# Altium schematic sheet DSO_RAM.SchDoc: Schematic_Name
size A4; CompanyName: University of Melbourne; Engineer: Your Name Here; DocumentNumber: 1; Revision: 0.1; SheetNumber: 1; SheetTotal: 1; Title_Project: Project_Title; StudentNo: Student No.
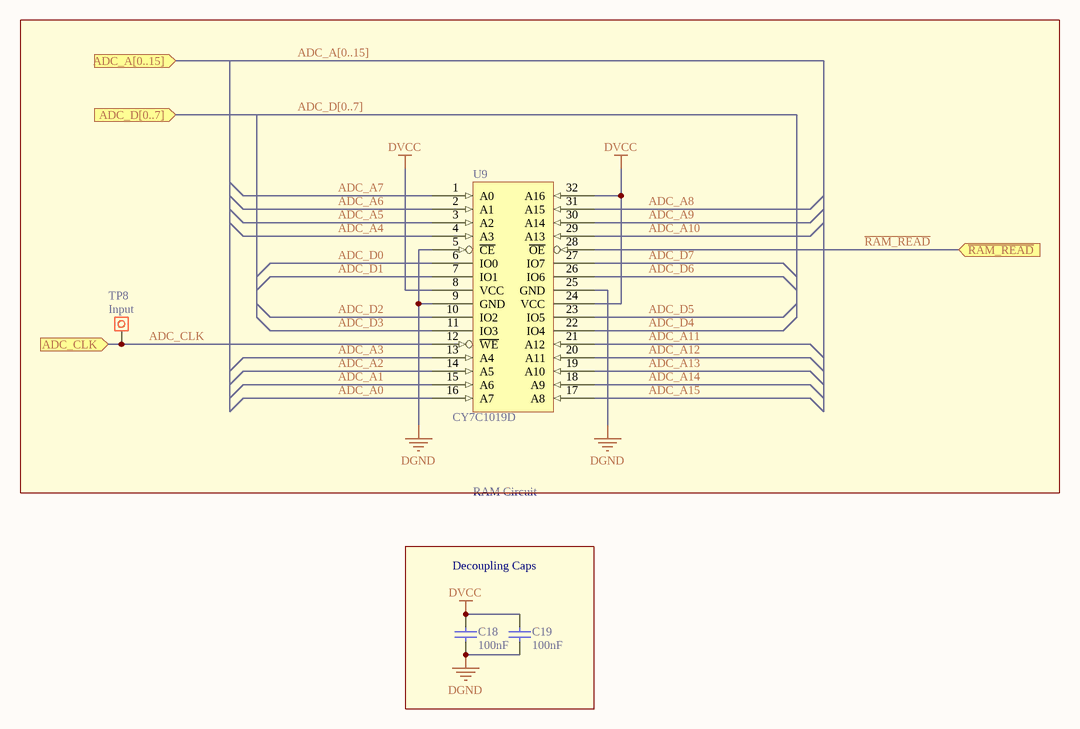
[diagram p0: DSO_RAM.SchDoc]

## Parts
C18  100nF  [0805C]
C19  100nF  [0805C]
TP8  INPUT  [Testpoin]
U9  CY7C1019D  [TSOP-32]

## Blocks framed on the sheet
Decoupling Caps: C18 C19

## Ports
ADC_A[0..15] (in), ADC_CLK (in), ADC_D[0..7] (in), ~{RAM_READ} (in)

## Nets
DGND: C18.2 C19.2 U9.5(~{CE}) U9.9(GND) U9.25(GND)
DVCC: C18.1 C19.1 U9.8(VCC) U9.24(VCC) U9.32(A16)
ADC_A0: U9.16(A7)
ADC_A1: U9.15(A6)
ADC_A2: U9.14(A5)
ADC_A3: U9.13(A4)
ADC_A4: U9.4(A3)
ADC_A5: U9.3(A2)
ADC_A6: U9.2(A1)
ADC_A7: U9.1(A0)
ADC_A8: U9.31(A15)
ADC_A9: U9.30(A14)
ADC_A10: U9.29(A13)
ADC_A11: U9.21(A12)
ADC_A12: U9.20(A11)
ADC_A13: U9.19(A10)
ADC_A14: U9.18(A9)
ADC_A15: U9.17(A8)
ADC_CLK: TP8.1 U9.12(~{WE}) ; port ADC_CLK
ADC_D0: U9.6(IO0)
ADC_D1: U9.7(IO1)
ADC_D2: U9.10(IO2)
ADC_D3: U9.11(IO3)
ADC_D4: U9.22(IO4)
ADC_D5: U9.23(IO5)
ADC_D6: U9.26(IO6)
ADC_D7: U9.27(IO7)
~{RAM_READ}: U9.28(~{OE}) ; port ~{RAM_READ}

## Buses and harness runs
bus ADC_A[0..15] = port ADC_A[0..15]
bus ADC_D[0..7] = port ADC_D[0..7]

## Notes on the sheet
- RAM Circuit

## Library data of the parts
C18 C19 = C: Capacitor; Reviewed by: RM - 2018/08/05; Revision: July-2002: Re-released for DXP Platform.; Value: 100nF; Supplier 1: *; Supplier Part Number 1: *
TP8 = Test Point: Pad; Value: Input
U9 = CY7C1019D: SRAM 128k x 8; Reviewed by: RM - 2018/08/05; Supplier 1: Digi-Key; Supplier Part Number 1: 428-1967-ND